# EAGLE design AST1003 (EAGLE 6.3)
DATABASE: ./../../../../../Components/TinyCircuits_Part_Database.txt
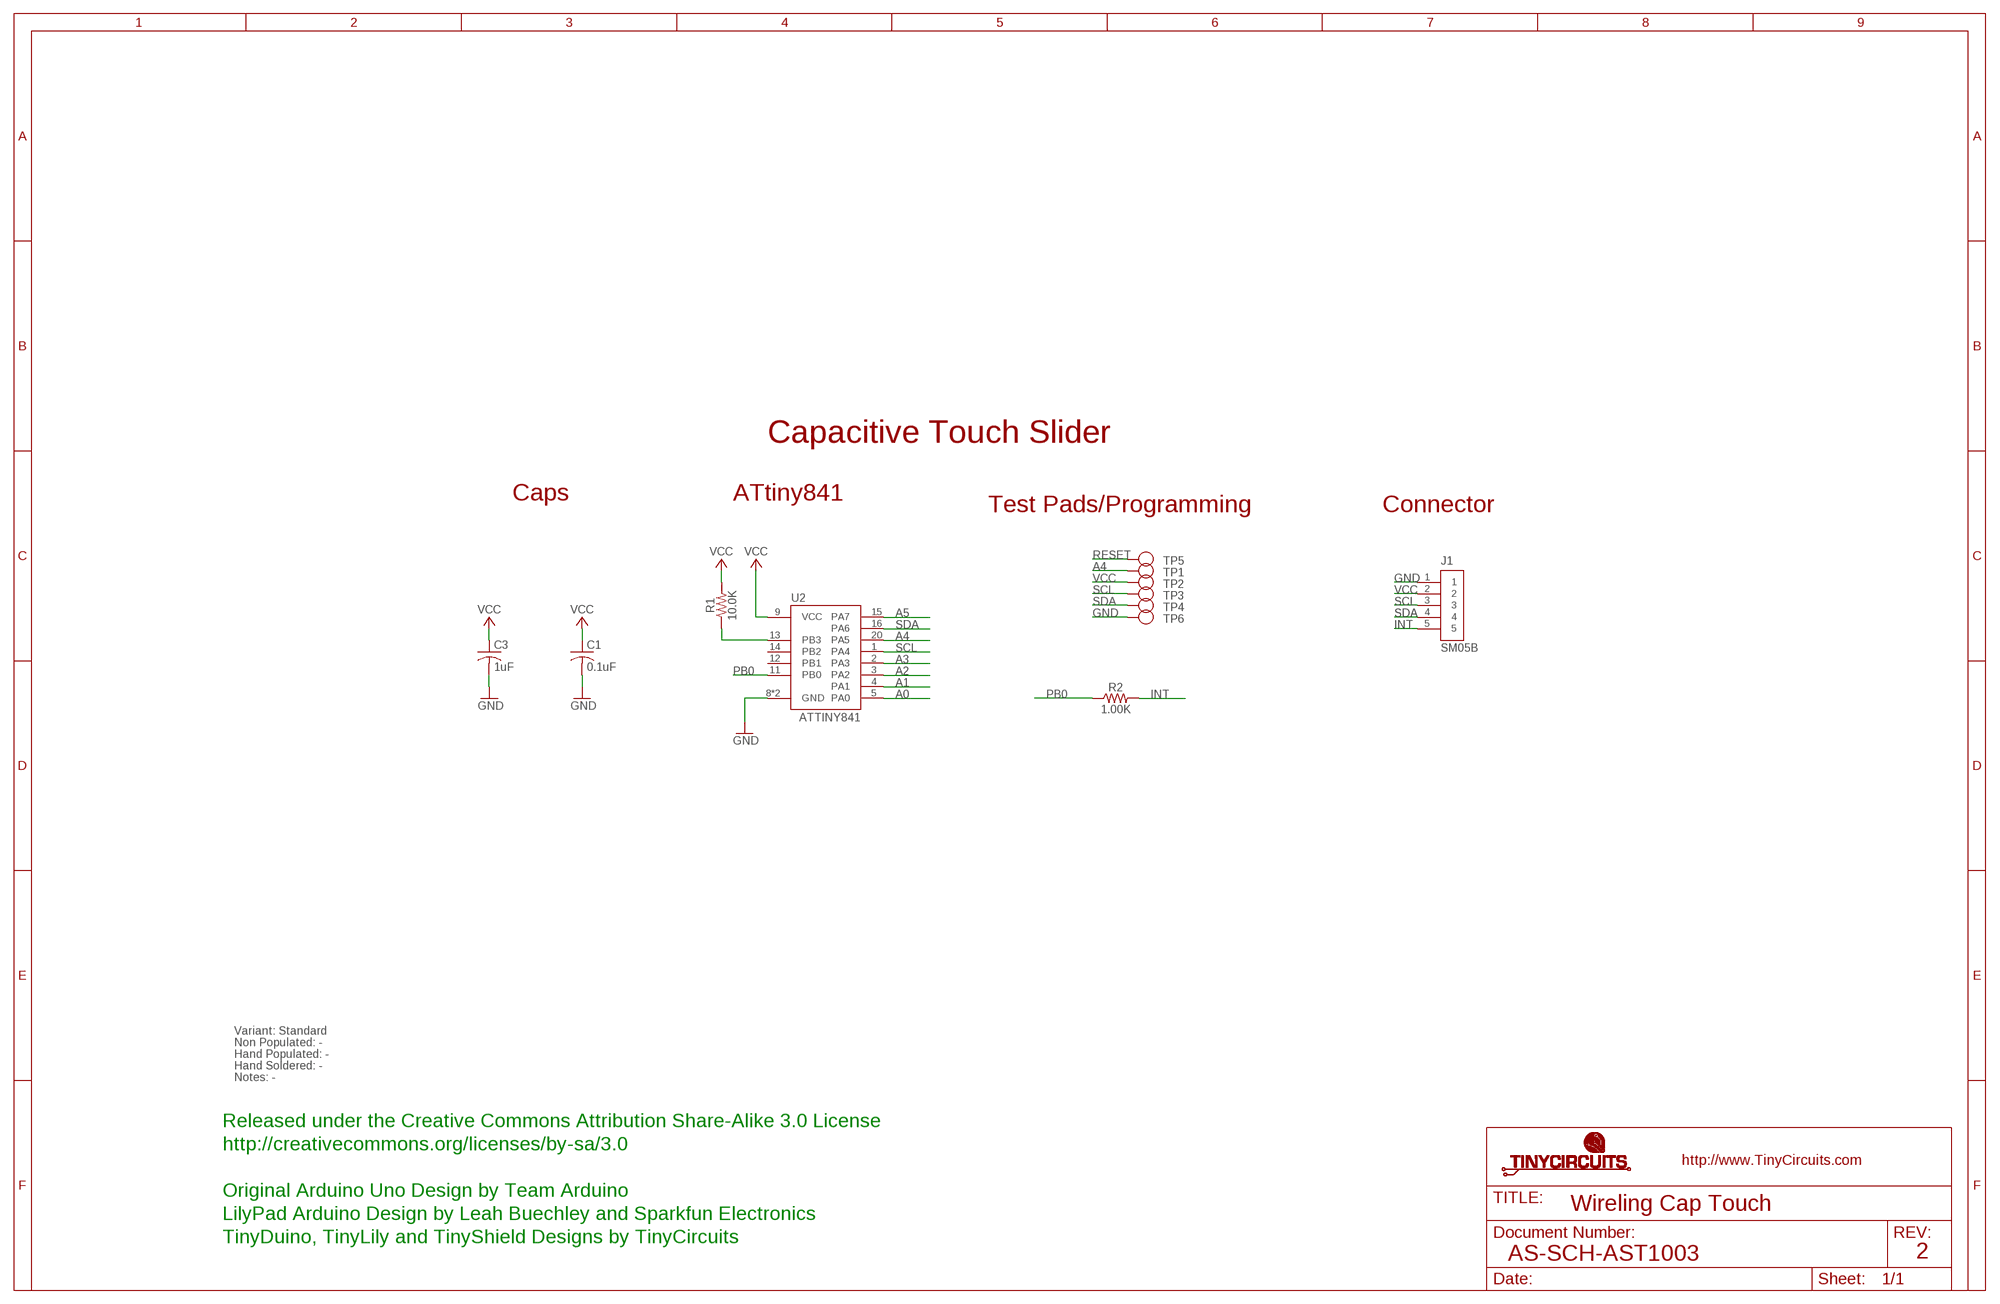
[diagram p0: schematic, sheet 1]

## Parts
C1  0.1uF  AS-ITM-00008  [C0402]
C3  1uF  AS-ITM-00410  [C0603]
J1  SM05B  AS-ITM-00340  [JST_SH_5X1]
R1  10.0K  AS-ITM-00032  [0402]
R2  1.00K  AS-ITM-00003  [0402]
TP1  TEST_POINT  [TEST_POINT_1MM]
TP2  TEST_POINT  [TEST_POINT_1MM]
TP3  TEST_POINT  [TEST_POINT_1MM]
TP4  TEST_POINT  [TEST_POINT_1MM]
TP5  TEST_POINT  [TEST_POINT_1MM]
TP6  TEST_POINT  [TEST_POINT_1MM]
U2  ATTINY841  AS-ITM-00255  [VQFN-20]

## Nets
A0: U2.5(PA0)
A1: U2.4(PA1)
A2: U2.3(PA2)
A3: U2.2(PA3)
A4: TP1.P$1 U2.20(PA5)
A5: U2.15(PA7)
GND: C1.2 C3.2 J1.1 TP6.P$1 U2.8(GND) U2.PAD(GND)
INT: J1.5 R2.2
PB0: R2.1 U2.11(PB0)
RESET: R1.1 TP5.P$1 U2.13(PB3)
SCL: J1.3 TP3.P$1 U2.1(PA4)
SDA: J1.4 TP4.P$1 U2.16(PA6)
VCC: C1.1 C3.1 J1.2 R1.2 TP2.P$1 U2.9(VCC)
Unconnected: U2.12(PB1) U2.14(PB2)

## Notes on the sheet
- Capacitive Touch Slider
- Caps | ATtiny841
- Test Pads/Programming | Connector
- Variant: Standard
- Non Populated: -
- Hand Populated: -
- Hand Soldered: -
- Notes: -
- Released under the Creative Commons Attribution Share-Alike 3.0 License
- http://creativecommons.org/licenses/by-sa/3.0
- Original Arduino Uno Design by Team Arduino
- Wireling Cap Touch
- LilyPad Arduino Design by Leah Buechley and Sparkfun Electronics
- TinyDuino, TinyLily and TinyShield Designs by TinyCircuits
- AS-SCH-AST1003 | 2

## Library data of the parts
C1 = tinycircuits:AS-ITM-00008: CAP CER 0.1UF 16V 10% X5R 0402; PARTNO: AS-ITM-00008
C3 = tinycircuits:AS-ITM-00410: CAP CER 1UF 10V X5R 0603; PARTNO: AS-ITM-00410
J1 = tinycircuits:AS-ITM-00340: CONN HEADER SH 5POS SIDE 1MM TIN; PARTNO: AS-ITM-00340; PNPROTATION: 180
R1 = tinycircuits:AS-ITM-00032: RES 10.0K OHM 1/16W 1% 0402 SMD; PARTNO: AS-ITM-00032
R2 = tinycircuits:AS-ITM-00003: RES 1.00K OHM 1/16W 1% 0402; PARTNO: AS-ITM-00003
TP1-TP6 = tinycircuits:TEST_POINT: Test point, no drill
U2 = tinycircuits:AS-ITM-00255: IC MCU 8BIT 8KB FLASH 20VQFN; PARTNO: AS-ITM-00255

## Net classes
2 gnd: width 0.305 mm, drill 0.559 mm, clearance 0.254 mm

## Board
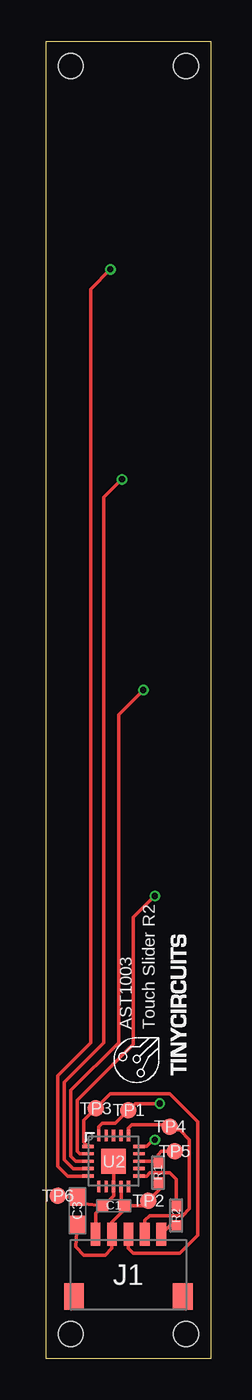
[diagram p1: board, top side]
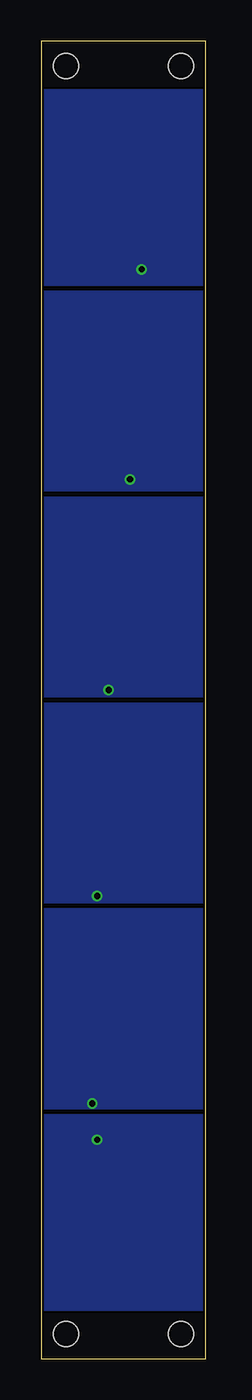
[diagram p2: board, bottom side, seen from below]

Size 10 x 80 mm. Coordinates in mm from the lower left corner, seen from the top.
Outline: 0,80 10,80 10,0 0,0 0,80
Copper layers (1*16): Top 0.035mm / dielectric 1.5mm / Bottom 0.035mm
Design rules "default *": minimum track width 8mil, minimum drill 15mil, track to track 7mil, track to pad 7mil, pad to pad 7mil, via to via 7mil, smd to smd 7mil, copper to edge 6mil, drill to drill 8mil, minimum pad ring 8mil, minimum via ring 5mil, stop-mask expansion 4mil, vias tented up to drill 25mil, thermal gap 10mil
Holes 1.5 mm at 8.5,1.5 1.5,1.5 1.5,78.5 8.5,78.5
tRestrict: 4 lines

### Footprints (pad centres in the part's own frame; a part is rotated, then mirrored left to right if it is on the bottom)
C0402 = smd 0.65 x 0.6: 1 -0.65,0; 2 0.65,0
C0603 = smd 1.1 x 1: 1 -0.85,0; 2 0.85,0
JST_SH_5X1 = smd 0.6 x 1.4: 1 -2,2.475; 2 -1,2.475; 3 0,2.475; 4 1,2.475; 5 2,2.475 | smd 1.2 x 1.6: PAD1 -3.3,-1.325; PAD2 3.3,-1.325
0402 = smd 0.65 x 0.55: 1 -0.6,0; 2 0.6,0
TEST_POINT_1MM = smd 1 x 1: P$1 0,0
VQFN-20 = smd 0.7 x 0.2: 1 -1.55,0.9; 2 -1.55,0.45; 3 -1.55,0; 4 -1.55,-0.45; 5 -1.55,-0.9; 11 1.55,-0.9; 12 1.55,-0.45; 13 1.55,0; 14 1.55,0.45; 15 1.55,0.9 | smd 0.2 x 0.7: 6 -0.9,-1.55; 7 -0.45,-1.55; 8 0,-1.55; 9 0.45,-1.55; 10 0.9,-1.55; 16 0.9,1.55; 17 0.45,1.55; 18 0,1.55; 19 -0.45,1.55; 20 -0.9,1.55 | smd 1.5 x 1.5: PAD 0,0

### Placement (x,y rotation side)
C1  4.1,9.3 180 top
C3  1.9,9 90 top
J1  5,5.1 0 top
R1  6.8,11.3 270 top
R2  7.9,8.7 270 top
TP1  5,15.1 0 top
TP2  6.2,9.6 0 top
TP3  3,15.2 0 top
TP4  7.5,14.1 0 top
TP5  7.8,12.6 0 top
TP6  0.7,9.9 0 top
U2  4.1,12 0 top
U$1  [DOCFIELD-TINYCIRCUITS-PCB]  22,-5 0 top  (outside the outline)

### Tracks (layer width: path | path; a pad name or v marks a point on that pad's centre or on a via)
A0  (via drill 0.38)
  Top 0.203: U2.5 1.3,11.1 0.7,11.7 0.7,17.2 2.7,19.2 2.7,64.95 v3.9,66.15
  pour Bottom: 0,77 10,77 10,65.25 0,65.25
A1  (via drill 0.38)
  Top 0.203: U2.4 1.65,11.55 1.1,12.1 1.1,16.8 3.5,19.2 3.5,52.3 v4.6,53.4
  pour Bottom: 0,64.75 10,64.75 10,52.75 0,52.75
A2  (via drill 0.38)
  Top 0.203: U2.3 1.8,12 1.5,12.3 1.5,16.3 4.4,19.2 4.4,39.1 v5.9,40.6
  pour Bottom: 0,52.25 10,52.25 10,40.25 0,40.25
A3  (via drill 0.38)
  Top 0.203: U2.2 2.05,12.45 1.9,12.6 1.9,15.7 5.3,19.1 5.3,26.8 v6.6,28.1
  pour Bottom: 0,39.75 10,39.75 10,27.75 0,27.75
A4  (via drill 0.38)
  Top 0.203: U2.20 3.2,14.1 3.4,14.3 4.2,14.3 TP1.P$1 5.4,15.5 v6.9,15.5
  pour Bottom: 0,27.25 10,27.25 10,15.25 0,15.25
A5  (via drill 0.38)
  Top 0.203: U2.15 6.1,12.9 6.5,13.3 v6.6,13.3
  pour Bottom: 0,14.75 10,14.75 10,3 0,3
GND
  Top 0.203: U2.PAD U2.8 4.1,9.9 3.6,9.4 3.45,9.4 C1.2 | J1.1 3,8.85 C1.2 | C1.2 2.25,9.4 C3.2 0.75,9.85 TP6.P$1
INT
  Top 0.203: R2.2 7.52,8.1 J1.5
PB0
  Top 0.203: 5.5,11.1 U2.11 6.1,11.1 6.3,11.3 7.5,11.3 7.9,10.9 R2.1
RESET
  Top 0.203: U2.13 6.7,12 R1.1 6.8,12.4 7,12.6 TP5.P$1
SCL
  Top 0.203: U2.1 2.3,13.15 2.3,14.5 TP3.P$1 3.9,16.1 7.5,16.1 9.2,14.4 9.2,7.5 8.1,6.4 5.3,6.4 5,6.7 J1.3
SDA
  Top 0.203: J1.4 6,8.4 6.3,8.7 8.3,8.7 8.7,9.1 8.7,13.3 8.1,13.9 7.7,13.9 TP4.P$1 7.4,14.2 5.2,14.2 5,14 U2.16
VCC
  Top 0.203: R1.2 7,10.4 TP2.P$1 5.9,9.3 C1.1 | C3.1 1.8,6.8 2.3,6.3 3.6,6.3 4,6.7 J1.2 4,8.3 4.6,8.9 4.6,9.45 C1.1 | U2.9 4.55,9.5 C1.1

### Text on the board
tPlace: AST1003 | Touch Slider R2
Document: FABRICATION DRAWING | NOTES: | 1. PRINTED CIRCUIT BOARD MADE FROM NEMA GRADE FR-4 EPOXY LAMINATE | WITH 1 OUNCE COPPER PLATING AND .024 THICKNESS. | 2. ALL DIMENSIONS ARE GIVEN IN INCHES. | 3. CIRCUIT PATHS ARE FOR REFERENCE ONLY. | 4. HOLE SIZES SHOWN ARE FINISHED DIAMETERS AFTER PLATING. | 5. BOARD PLATED USING REFLOW OR SIMILAR METHOD. | 6. BOARD TO HAVE BLUE SOLDER MASK ON PLATED SURFACES USING WET FILM | 7. SILKSCREEN BOARD USING WHITE INK. | SR100 OR SR1010 EPOXY. EQUIVALENT WET OR DRY FILM MAY BE USED. | 8. THE FOLLOWING INFORMATION APPLIES TO THIS BOARD: | * 2 COPPER LAYERS | * .024 BOARD THICKNESS | * REQUIRES TOP SIDE SILKSCREEN | Wireling Cap Touch | AS-PCB-AST1003 | 2